# Altium schematic sheet POWER_PART.SchDoc
size A4
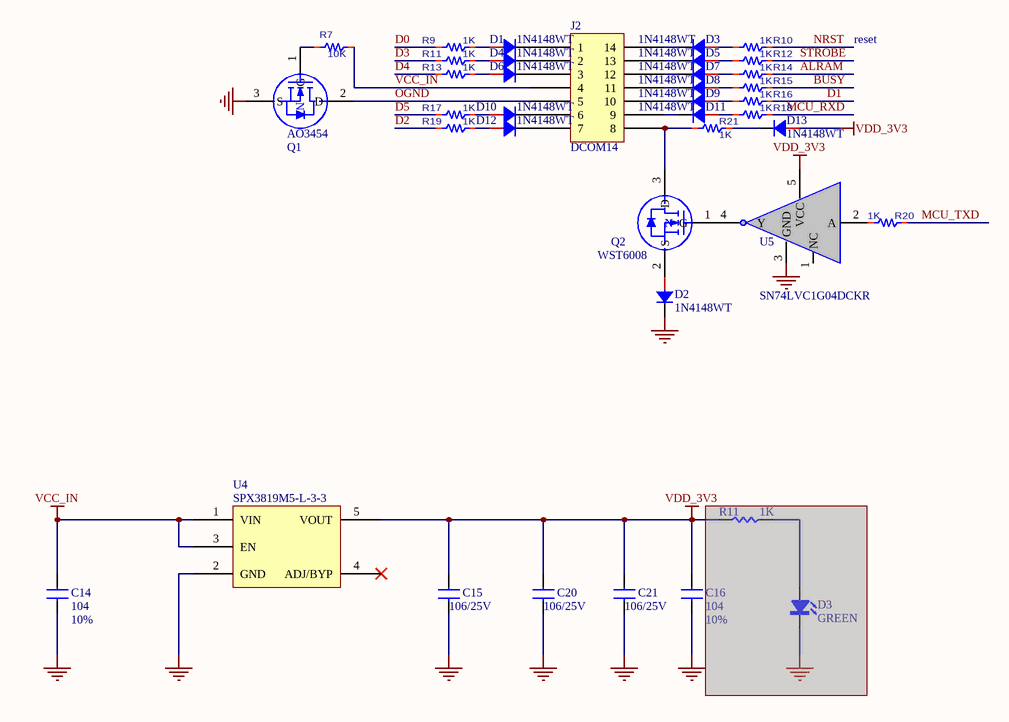
[diagram p0: POWER_PART.SchDoc]

## Parts
(Parts that share a designator on the sheet are numbered #1, #2 ... from top to bottom, then left to right.)
C14  104  [0603C/1]
C15  106/25V  [0603C/1]
C16  104  [0603C/1]
C20  106/25V  [0603C/1]
C21  106/25V  [0603C/1]
D1  1N4148WT  [SOD-523_L1.2-W0.8]
D2  1N4148WT  [SOD-523_L1.2-W0.8]
D3#1  1N4148WT  [SOD-523_L1.2-W0.8]
D3#2  GREEN  [LED_DIP_2.54]  (masked out: inside a compile mask, not in the netlist)
D4  1N4148WT  [SOD-523_L1.2-W0.8]
D5  1N4148WT  [SOD-523_L1.2-W0.8]
D6  1N4148WT  [SOD-523_L1.2-W0.8]
D7  1N4148WT  [SOD-523_L1.2-W0.8]
D8  1N4148WT  [SOD-523_L1.2-W0.8]
D9  1N4148WT  [SOD-523_L1.2-W0.8]
D10  1N4148WT  [SOD-523_L1.2-W0.8]
D11  1N4148WT  [SOD-523_L1.2-W0.8]
D12  1N4148WT  [SOD-523_L1.2-W0.8]
D13  1N4148WT  [SOD-523_L1.2-W0.8]
J2  DCOM14  [DIP14-300]
Q1  AO3454  [SOT-23-N]
Q2  WST6008  [SOT-523-3_L1.6-W0.8-P1.00-LS1.6]
R7  10K  [0603R/1]
R9  1K  [0402R/1]
R10  1K  [0402R/1]
R11#1  1K  [0402R/1]
R11#2  1K  [0603R/1]  (masked out: inside a compile mask, not in the netlist)
R12  1K  [0402R/1]
R13  1K  [0402R/1]
R14  1K  [0402R/1]
R15  1K  [0402R/1]
R16  1K  [0402R/1]
R17  1K  [0402R/1]
R18  1K  [0402R/1]
R19  1K  [0402R/1]
R20  1K  [0402R/1]
R21  1K  [0603R/1]
U4  SPX3819M5-L-3-3  [SOT-23-5]
U5  SN74LVC1G04DCKR  [SC-70-5_L2.1-W1.3-P0.65-LS2.1-TL]

## Nets
GND: C14.1 C15.1 C16.1 C20.1 C21.1 D2.2 Q1.3(S) U4.2(GND) U5.3(GND)
VCC_IN: C14.2 J2.4 R7.2 U4.1(VIN) U4.3(EN)
VDD_3V3: C15.2 C16.2 C20.2 C21.2 D13.1 U4.5(VOUT) U5.5(VCC)
ALRAM: R14.2
BUSY: R15.2
D0: R9.1
D1: R16.2
D2: R19.1
D3: R11#1.1
D4: R13.1
D5: R17.1
MCU_RXD: R18.2
MCU_TXD: R20.2
NRST: R10.2
OGND: J2.5 Q1.2(D)
STROBE: R12.2
NetD1_1: D1.1 R9.2
NetD1_2: D1.2 J2.1
NetD2_1: D2.1 Q2.2(S)
NetD3#1_1: D3#1.1 R10.1
NetD3#1_2: D3#1.2 J2.14
NetD4_1: D4.1 R11#1.2
NetD4_2: D4.2 J2.2
NetD5_1: D5.1 R12.1
NetD5_2: D5.2 J2.13
NetD6_1: D6.1 R13.2
NetD6_2: D6.2 J2.3
NetD7_1: D7.1 R14.1
NetD7_2: D7.2 J2.12
NetD8_1: D8.1 R15.1
NetD8_2: D8.2 J2.11
NetD9_1: D9.1 R16.1
NetD9_2: D9.2 J2.10
NetD10_1: D10.1 R17.2
NetD10_2: D10.2 J2.6
NetD11_1: D11.1 R18.1
NetD11_2: D11.2 J2.9
NetD12_1: D12.1 R19.2
NetD12_2: D12.2 J2.7
NetD13_2: D13.2 R21.2
NetJ2_8: J2.8 Q2.3(D) R21.1
NetQ1_1: Q1.1(G) R7.1
NetQ2_1: Q2.1(G) U5.4(Y)
NetR20_1: R20.1 U5.2(A)

Not connected (* = marked no-connect by the designer): U4 4(ADJ/BYP)*; U5 1(NC)

## Notes on the sheet
- reset
- (in symbol AO3400) N
- (in symbol MOS_N) N
- (in symbol 电容) 10%

## Library data of the parts
C14-C16 C20 C21 = 电容: Capacitor
D1 D2 D3#1 D4-D13 = DIODE_5
D3#2 = LED
Q1 = AO3400
Q2 = MOS_N
R7 R9 R10 R11#1 R12-R21 = RESS1: Resistor
R11#2 = RES_4G
U4 = SPX3819/1
U5 = SN74LVC1G04